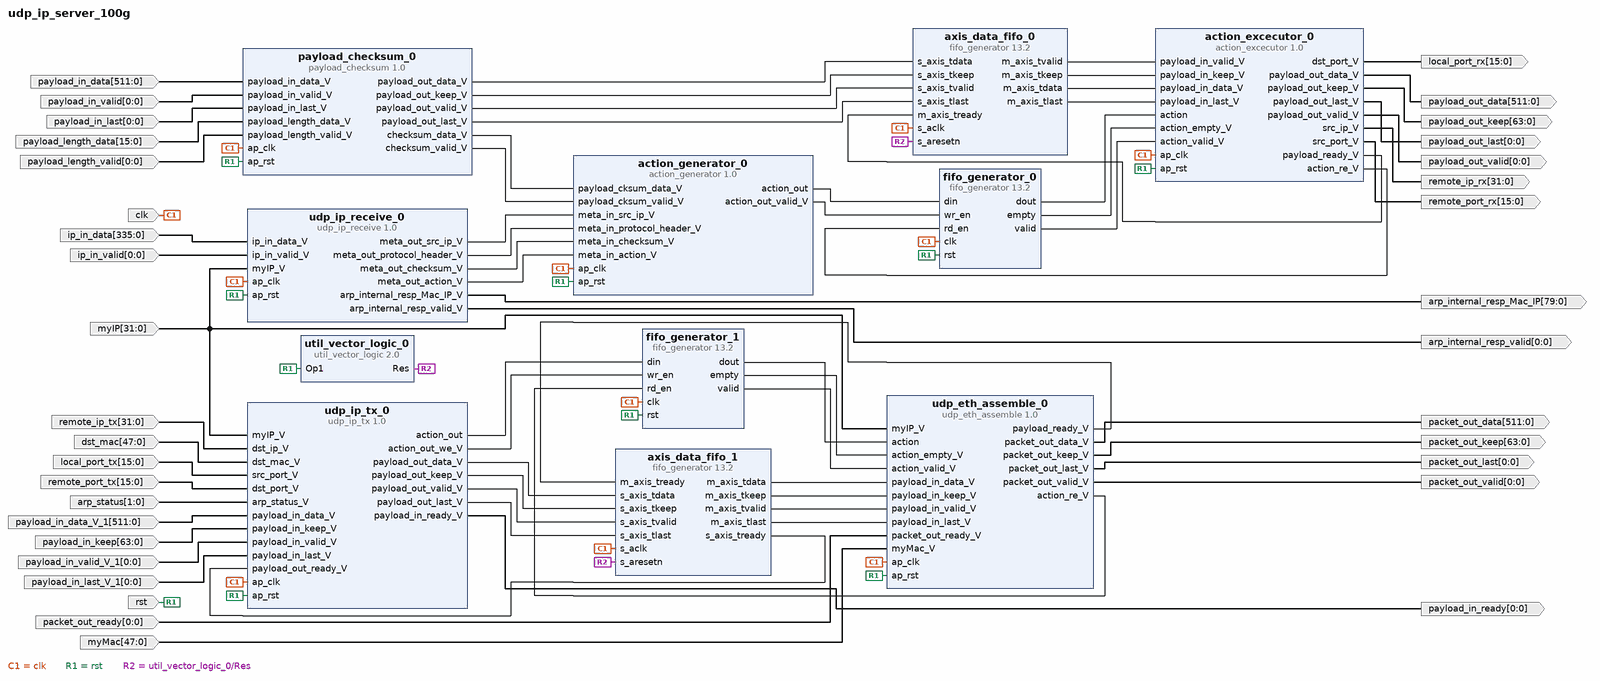
[diagram p0: block diagram of the top level]
# Vivado block design udp_ip_server_100g, xcu280-fsvh2892-2L-e, Vivado 2019.1
create_bd_design udp_ip_server_100g

create_bd_port -dir I -type clk clk
create_bd_port -dir I -type rst rst
set_property -dict {CONFIG.POLARITY ACTIVE_HIGH} [get_bd_ports rst]
create_bd_port -dir I -from 31 -to 0 -type data myIP
create_bd_port -dir I -from 335 -to 0 -type data ip_in_data
create_bd_port -dir I -from 0 -to 0 -type data ip_in_valid
create_bd_port -dir I -from 511 -to 0 -type data payload_in_data
create_bd_port -dir I -from 0 -to 0 -type data payload_in_valid
create_bd_port -dir I -from 0 -to 0 -type data payload_in_last
create_bd_port -dir I -from 15 -to 0 -type data payload_length_data
create_bd_port -dir I -from 0 -to 0 -type data payload_length_valid
create_bd_port -dir O -from 511 -to 0 -type data payload_out_data
create_bd_port -dir O -from 63 -to 0 -type data payload_out_keep
create_bd_port -dir O -from 0 -to 0 -type data payload_out_valid
create_bd_port -dir O -from 0 -to 0 -type data payload_out_last
create_bd_port -dir O -from 31 -to 0 -type data remote_ip_rx
create_bd_port -dir O -from 15 -to 0 -type data remote_port_rx
create_bd_port -dir O -from 15 -to 0 -type data local_port_rx
create_bd_port -dir I -from 31 -to 0 -type data remote_ip_tx
create_bd_port -dir I -from 47 -to 0 -type data dst_mac
create_bd_port -dir I -from 15 -to 0 -type data local_port_tx
create_bd_port -dir I -from 15 -to 0 -type data remote_port_tx
create_bd_port -dir I -from 1 -to 0 -type data arp_status
create_bd_port -dir I -from 511 -to 0 -type data payload_in_data_V_1
create_bd_port -dir I -from 63 -to 0 -type data payload_in_keep
create_bd_port -dir I -from 0 -to 0 -type data payload_in_valid_V_1
create_bd_port -dir I -from 0 -to 0 -type data payload_in_last_V_1
create_bd_port -dir O -from 0 -to 0 -type data payload_in_ready
create_bd_port -dir I -from 0 -to 0 -type data packet_out_ready
create_bd_port -dir O -from 511 -to 0 -type data packet_out_data
create_bd_port -dir O -from 63 -to 0 -type data packet_out_keep
create_bd_port -dir O -from 0 -to 0 -type data packet_out_valid
create_bd_port -dir O -from 0 -to 0 -type data packet_out_last
create_bd_port -dir I -from 47 -to 0 -type data myMac
create_bd_port -dir O -from 79 -to 0 -type data arp_internal_resp_Mac_IP
create_bd_port -dir O -from 0 -to 0 -type data arp_internal_resp_valid

create_bd_cell -type ip -vlnv xilinx.com:hls:udp_ip_receive:1.0 udp_ip_receive_0
create_bd_cell -type ip -vlnv xilinx.com:hls:action_generator:1.0 action_generator_0
create_bd_cell -type ip -vlnv xilinx.com:hls:payload_checksum:1.0 payload_checksum_0
create_bd_cell -type ip -vlnv xilinx.com:hls:action_excecutor:1.0 action_excecutor_0
create_bd_cell -type ip -vlnv xilinx.com:ip:fifo_generator:13.2 fifo_generator_0
set_property -dict [list \
  CONFIG.Enable_Safety_Circuit false \
  CONFIG.Fifo_Implementation Common_Clock_Block_RAM \
  CONFIG.Full_Flags_Reset_Value 1 \
  CONFIG.Input_Data_Width 65 \
  CONFIG.Input_Depth 256 \
  CONFIG.Performance_Options First_Word_Fall_Through \
  CONFIG.Reset_Type Asynchronous_Reset \
  CONFIG.Use_Embedded_Registers false \
  CONFIG.Valid_Flag true \
] [get_bd_cells fifo_generator_0]
create_bd_cell -type ip -vlnv xilinx.com:ip:fifo_generator:13.2 fifo_generator_1
set_property -dict [list \
  CONFIG.Enable_Safety_Circuit false \
  CONFIG.Fifo_Implementation Common_Clock_Block_RAM \
  CONFIG.Full_Flags_Reset_Value 1 \
  CONFIG.Input_Data_Width 161 \
  CONFIG.Input_Depth 256 \
  CONFIG.Performance_Options First_Word_Fall_Through \
  CONFIG.Reset_Type Asynchronous_Reset \
  CONFIG.Use_Embedded_Registers false \
  CONFIG.Valid_Flag true \
] [get_bd_cells fifo_generator_1]
create_bd_cell -type ip -vlnv xilinx.com:ip:fifo_generator:13.2 axis_data_fifo_0
set_property -dict [list \
  CONFIG.Enable_TLAST true \
  CONFIG.FIFO_Implementation_axis Common_Clock_Block_RAM \
  CONFIG.FIFO_Implementation_rach Common_Clock_Distributed_RAM \
  CONFIG.FIFO_Implementation_rdch Common_Clock_Builtin_FIFO \
  CONFIG.FIFO_Implementation_wach Common_Clock_Distributed_RAM \
  CONFIG.FIFO_Implementation_wdch Common_Clock_Builtin_FIFO \
  CONFIG.FIFO_Implementation_wrch Common_Clock_Distributed_RAM \
  CONFIG.HAS_TKEEP true \
  CONFIG.INTERFACE_TYPE AXI_STREAM \
  CONFIG.Input_Depth_axis 256 \
  CONFIG.TDATA_NUM_BYTES 64 \
  CONFIG.TUSER_WIDTH 0 \
] [get_bd_cells axis_data_fifo_0]
create_bd_cell -type ip -vlnv xilinx.com:ip:fifo_generator:13.2 axis_data_fifo_1
set_property -dict [list \
  CONFIG.Enable_TLAST true \
  CONFIG.FIFO_Implementation_axis Common_Clock_Block_RAM \
  CONFIG.FIFO_Implementation_rach Common_Clock_Distributed_RAM \
  CONFIG.FIFO_Implementation_rdch Common_Clock_Builtin_FIFO \
  CONFIG.FIFO_Implementation_wach Common_Clock_Distributed_RAM \
  CONFIG.FIFO_Implementation_wdch Common_Clock_Builtin_FIFO \
  CONFIG.FIFO_Implementation_wrch Common_Clock_Distributed_RAM \
  CONFIG.HAS_TKEEP true \
  CONFIG.INTERFACE_TYPE AXI_STREAM \
  CONFIG.Input_Depth_axis 256 \
  CONFIG.TDATA_NUM_BYTES 64 \
  CONFIG.TUSER_WIDTH 0 \
] [get_bd_cells axis_data_fifo_1]
create_bd_cell -type ip -vlnv xilinx.com:hls:udp_eth_assemble:1.0 udp_eth_assemble_0
create_bd_cell -type ip -vlnv xilinx.com:hls:udp_ip_tx:1.0 udp_ip_tx_0
create_bd_cell -type ip -vlnv xilinx.com:ip:util_vector_logic:2.0 util_vector_logic_0
set_property -dict {CONFIG.C_OPERATION not CONFIG.C_SIZE 1} [get_bd_cells util_vector_logic_0]

# ---- connections ----

connect_bd_net -net ap_clk_0_1 [get_bd_ports clk] \
  [get_bd_pins udp_ip_receive_0/ap_clk] [get_bd_pins payload_checksum_0/ap_clk] [get_bd_pins udp_eth_assemble_0/ap_clk] \
  [get_bd_pins action_excecutor_0/ap_clk] [get_bd_pins action_generator_0/ap_clk] [get_bd_pins axis_data_fifo_0/s_aclk] \
  [get_bd_pins axis_data_fifo_1/s_aclk] [get_bd_pins fifo_generator_0/clk] [get_bd_pins fifo_generator_1/clk] \
  [get_bd_pins udp_ip_tx_0/ap_clk]
connect_bd_net -net ap_rst_0_1 [get_bd_ports rst] \
  [get_bd_pins udp_ip_receive_0/ap_rst] [get_bd_pins payload_checksum_0/ap_rst] [get_bd_pins udp_eth_assemble_0/ap_rst] \
  [get_bd_pins udp_ip_tx_0/ap_rst] [get_bd_pins action_excecutor_0/ap_rst] [get_bd_pins action_generator_0/ap_rst] \
  [get_bd_pins util_vector_logic_0/Op1] [get_bd_pins fifo_generator_0/rst] [get_bd_pins fifo_generator_1/rst]
connect_bd_net -net myIP_V_0_1 [get_bd_ports myIP] \
  [get_bd_pins udp_ip_receive_0/myIP_V] [get_bd_pins udp_eth_assemble_0/myIP_V] [get_bd_pins udp_ip_tx_0/myIP_V]
connect_bd_net -net ip_in_data_V_0_1 [get_bd_ports ip_in_data] [get_bd_pins udp_ip_receive_0/ip_in_data_V]
connect_bd_net -net ip_in_valid_V_0_1 [get_bd_ports ip_in_valid] [get_bd_pins udp_ip_receive_0/ip_in_valid_V]
connect_bd_net -net payload_in_data_V_0_1 [get_bd_ports payload_in_data] [get_bd_pins payload_checksum_0/payload_in_data_V]
connect_bd_net -net payload_in_valid_V_0_1 [get_bd_ports payload_in_valid] [get_bd_pins payload_checksum_0/payload_in_valid_V]
connect_bd_net -net payload_in_last_V_0_1 [get_bd_ports payload_in_last] [get_bd_pins payload_checksum_0/payload_in_last_V]
connect_bd_net -net payload_length_data_V_0_1 [get_bd_ports payload_length_data] [get_bd_pins payload_checksum_0/payload_length_data_V]
connect_bd_net -net payload_length_valid_V_0_1 [get_bd_ports payload_length_valid] [get_bd_pins payload_checksum_0/payload_length_valid_V]
connect_bd_net [get_bd_pins action_excecutor_0/payload_out_data_V] [get_bd_ports payload_out_data]
connect_bd_net [get_bd_pins action_excecutor_0/payload_out_keep_V] [get_bd_ports payload_out_keep]
connect_bd_net [get_bd_pins action_excecutor_0/payload_out_valid_V] [get_bd_ports payload_out_valid]
connect_bd_net [get_bd_pins action_excecutor_0/payload_out_last_V] [get_bd_ports payload_out_last]
connect_bd_net [get_bd_pins action_excecutor_0/src_ip_V] [get_bd_ports remote_ip_rx]
connect_bd_net [get_bd_pins action_excecutor_0/src_port_V] [get_bd_ports remote_port_rx]
connect_bd_net [get_bd_pins action_excecutor_0/dst_port_V] [get_bd_ports local_port_rx]
connect_bd_net -net dst_ip_V_0_1 [get_bd_ports remote_ip_tx] [get_bd_pins udp_ip_tx_0/dst_ip_V]
connect_bd_net -net dst_mac_V_0_1 [get_bd_ports dst_mac] [get_bd_pins udp_ip_tx_0/dst_mac_V]
connect_bd_net -net src_port_V_1_1 [get_bd_ports local_port_tx] [get_bd_pins udp_ip_tx_0/src_port_V]
connect_bd_net -net dst_port_V_1_1 [get_bd_ports remote_port_tx] [get_bd_pins udp_ip_tx_0/dst_port_V]
connect_bd_net -net arp_status_V_0_1 [get_bd_ports arp_status] [get_bd_pins udp_ip_tx_0/arp_status_V]
connect_bd_net -net payload_in_data_V_1_1 [get_bd_ports payload_in_data_V_1] [get_bd_pins udp_ip_tx_0/payload_in_data_V]
connect_bd_net -net payload_in_keep_V_0_1 [get_bd_ports payload_in_keep] [get_bd_pins udp_ip_tx_0/payload_in_keep_V]
connect_bd_net -net payload_in_valid_V_1_1 [get_bd_ports payload_in_valid_V_1] [get_bd_pins udp_ip_tx_0/payload_in_valid_V]
connect_bd_net -net payload_in_last_V_1_1 [get_bd_ports payload_in_last_V_1] [get_bd_pins udp_ip_tx_0/payload_in_last_V]
connect_bd_net [get_bd_pins udp_ip_tx_0/payload_in_ready_V] [get_bd_ports payload_in_ready]
connect_bd_net -net packet_out_ready_V_0_1 [get_bd_ports packet_out_ready] [get_bd_pins udp_eth_assemble_0/packet_out_ready_V]
connect_bd_net [get_bd_pins udp_eth_assemble_0/packet_out_data_V] [get_bd_ports packet_out_data]
connect_bd_net [get_bd_pins udp_eth_assemble_0/packet_out_keep_V] [get_bd_ports packet_out_keep]
connect_bd_net [get_bd_pins udp_eth_assemble_0/packet_out_valid_V] [get_bd_ports packet_out_valid]
connect_bd_net [get_bd_pins udp_eth_assemble_0/packet_out_last_V] [get_bd_ports packet_out_last]
connect_bd_net -net myMac_V_0_1 [get_bd_ports myMac] [get_bd_pins udp_eth_assemble_0/myMac_V]
connect_bd_net [get_bd_pins udp_ip_receive_0/arp_internal_resp_Mac_IP_V] [get_bd_ports arp_internal_resp_Mac_IP]
connect_bd_net [get_bd_pins udp_ip_receive_0/arp_internal_resp_valid_V] [get_bd_ports arp_internal_resp_valid]
connect_bd_net [get_bd_pins util_vector_logic_0/Res] [get_bd_pins axis_data_fifo_0/s_aresetn] [get_bd_pins axis_data_fifo_1/s_aresetn]
connect_bd_net [get_bd_pins udp_ip_receive_0/meta_out_src_ip_V] [get_bd_pins action_generator_0/meta_in_src_ip_V]
connect_bd_net [get_bd_pins udp_ip_receive_0/meta_out_protocol_header_V] [get_bd_pins action_generator_0/meta_in_protocol_header_V]
connect_bd_net [get_bd_pins udp_ip_receive_0/meta_out_checksum_V] [get_bd_pins action_generator_0/meta_in_checksum_V]
connect_bd_net [get_bd_pins udp_ip_receive_0/meta_out_action_V] [get_bd_pins action_generator_0/meta_in_action_V]
connect_bd_net [get_bd_pins action_generator_0/action_out] [get_bd_pins fifo_generator_0/din]
connect_bd_net [get_bd_pins action_generator_0/action_out_valid_V] [get_bd_pins fifo_generator_0/wr_en]
connect_bd_net [get_bd_pins fifo_generator_0/dout] [get_bd_pins action_excecutor_0/action]
connect_bd_net [get_bd_pins action_excecutor_0/action_re_V] [get_bd_pins fifo_generator_0/rd_en]
connect_bd_net [get_bd_pins fifo_generator_0/empty] [get_bd_pins action_excecutor_0/action_empty_V]
connect_bd_net [get_bd_pins fifo_generator_0/valid] [get_bd_pins action_excecutor_0/action_valid_V]
connect_bd_net [get_bd_pins payload_checksum_0/payload_out_data_V] [get_bd_pins axis_data_fifo_0/s_axis_tdata]
connect_bd_net [get_bd_pins payload_checksum_0/payload_out_keep_V] [get_bd_pins axis_data_fifo_0/s_axis_tkeep]
connect_bd_net [get_bd_pins payload_checksum_0/payload_out_valid_V] [get_bd_pins axis_data_fifo_0/s_axis_tvalid]
connect_bd_net [get_bd_pins payload_checksum_0/payload_out_last_V] [get_bd_pins axis_data_fifo_0/s_axis_tlast]
connect_bd_net [get_bd_pins axis_data_fifo_0/m_axis_tvalid] [get_bd_pins action_excecutor_0/payload_in_valid_V]
connect_bd_net [get_bd_pins axis_data_fifo_0/m_axis_tkeep] [get_bd_pins action_excecutor_0/payload_in_keep_V]
connect_bd_net [get_bd_pins axis_data_fifo_0/m_axis_tdata] [get_bd_pins action_excecutor_0/payload_in_data_V]
connect_bd_net [get_bd_pins axis_data_fifo_0/m_axis_tlast] [get_bd_pins action_excecutor_0/payload_in_last_V]
connect_bd_net [get_bd_pins action_excecutor_0/payload_ready_V] [get_bd_pins axis_data_fifo_0/m_axis_tready]
connect_bd_net [get_bd_pins payload_checksum_0/checksum_data_V] [get_bd_pins action_generator_0/payload_cksum_data_V]
connect_bd_net [get_bd_pins payload_checksum_0/checksum_valid_V] [get_bd_pins action_generator_0/payload_cksum_valid_V]
connect_bd_net [get_bd_pins axis_data_fifo_1/s_axis_tready] [get_bd_pins udp_ip_tx_0/payload_out_ready_V]
connect_bd_net [get_bd_pins udp_ip_tx_0/payload_out_data_V] [get_bd_pins axis_data_fifo_1/s_axis_tdata]
connect_bd_net [get_bd_pins udp_ip_tx_0/payload_out_keep_V] [get_bd_pins axis_data_fifo_1/s_axis_tkeep]
connect_bd_net [get_bd_pins udp_ip_tx_0/payload_out_valid_V] [get_bd_pins axis_data_fifo_1/s_axis_tvalid]
connect_bd_net [get_bd_pins udp_ip_tx_0/payload_out_last_V] [get_bd_pins axis_data_fifo_1/s_axis_tlast]
connect_bd_net [get_bd_pins udp_ip_tx_0/action_out] [get_bd_pins fifo_generator_1/din]
connect_bd_net [get_bd_pins udp_ip_tx_0/action_out_we_V] [get_bd_pins fifo_generator_1/wr_en]
connect_bd_net [get_bd_pins fifo_generator_1/dout] [get_bd_pins udp_eth_assemble_0/action]
connect_bd_net [get_bd_pins udp_eth_assemble_0/action_re_V] [get_bd_pins fifo_generator_1/rd_en]
connect_bd_net [get_bd_pins fifo_generator_1/empty] [get_bd_pins udp_eth_assemble_0/action_empty_V]
connect_bd_net [get_bd_pins fifo_generator_1/valid] [get_bd_pins udp_eth_assemble_0/action_valid_V]
connect_bd_net [get_bd_pins axis_data_fifo_1/m_axis_tdata] [get_bd_pins udp_eth_assemble_0/payload_in_data_V]
connect_bd_net [get_bd_pins axis_data_fifo_1/m_axis_tkeep] [get_bd_pins udp_eth_assemble_0/payload_in_keep_V]
connect_bd_net [get_bd_pins axis_data_fifo_1/m_axis_tvalid] [get_bd_pins udp_eth_assemble_0/payload_in_valid_V]
connect_bd_net [get_bd_pins axis_data_fifo_1/m_axis_tlast] [get_bd_pins udp_eth_assemble_0/payload_in_last_V]
connect_bd_net [get_bd_pins udp_eth_assemble_0/payload_ready_V] [get_bd_pins axis_data_fifo_1/m_axis_tready]

validate_bd_design
save_bd_design
